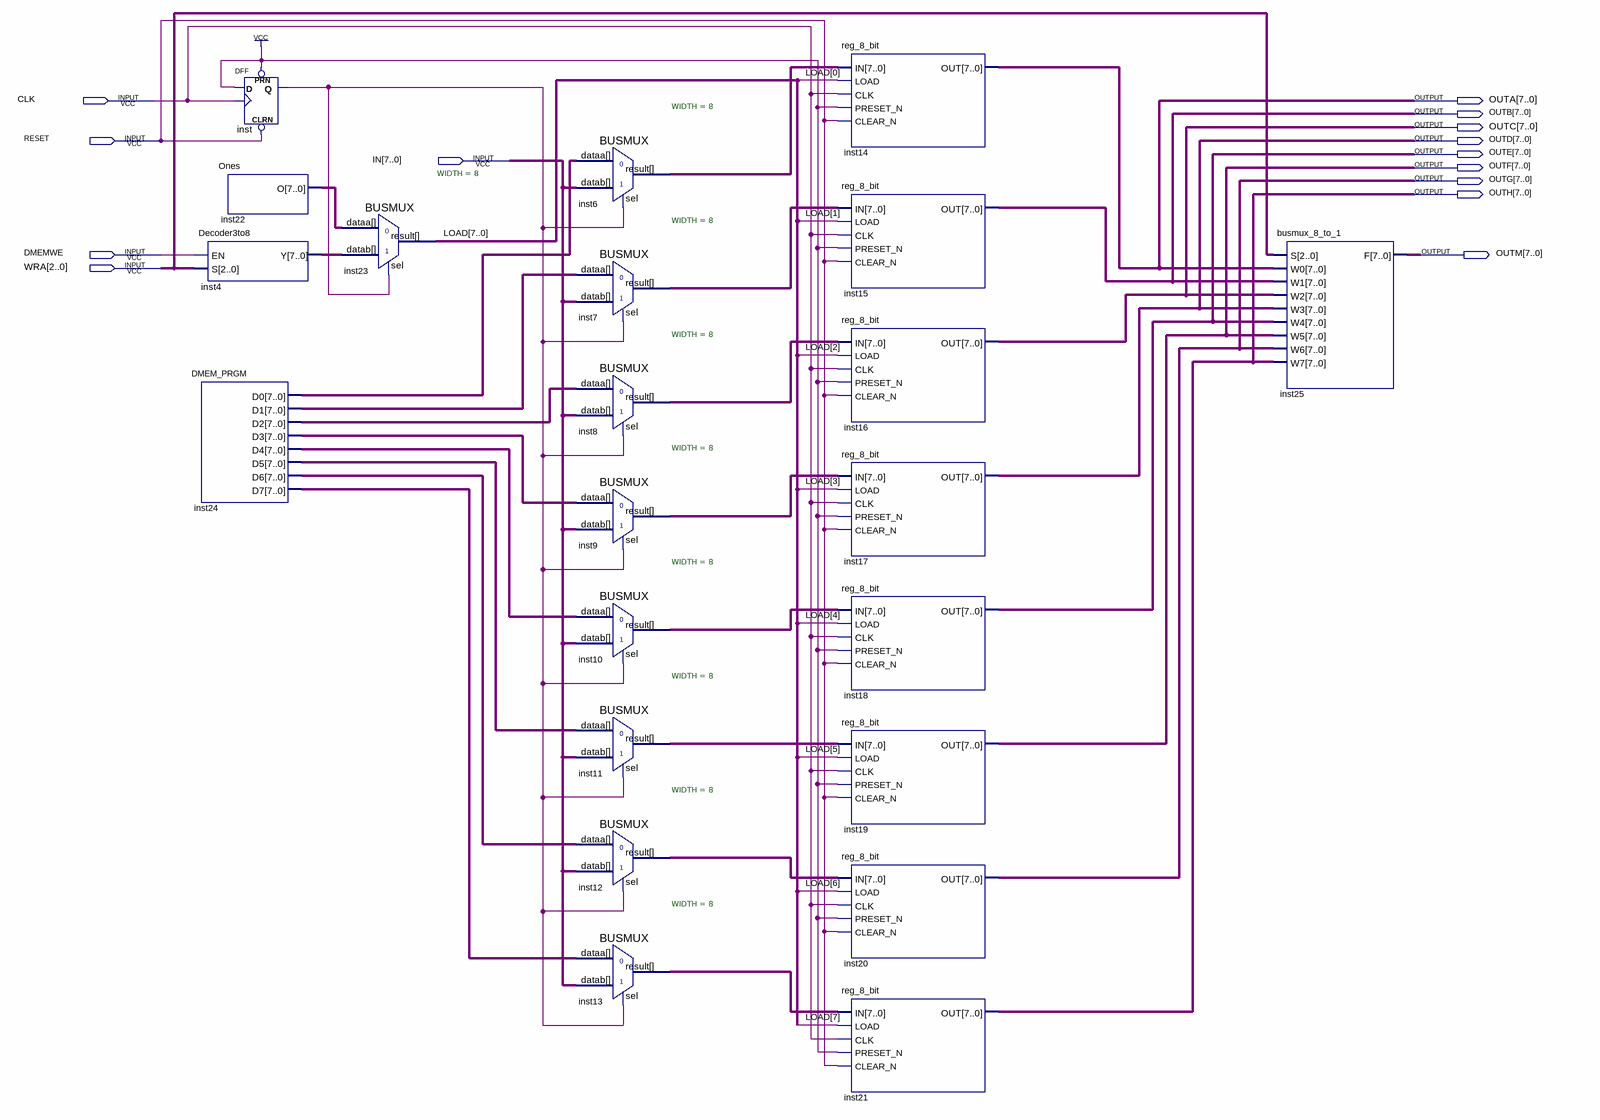
[diagram p0: schematic sheet]
// Quartus schematic DMEM.bdf as structural Verilog: 22 symbols, 14 pins
module DMEM (
  input  CLK,
  input  RESET,
  input  [7:0] IN,
  input  DMEMWE,
  input  [2:0] WRA,
  output [7:0] OUTA,
  output [7:0] OUTB,
  output [7:0] OUTC,
  output [7:0] OUTD,
  output [7:0] OUTE,
  output [7:0] OUTF,
  output [7:0] OUTG,
  output [7:0] OUTH,
  output [7:0] OUTM
);

  wire inst_q;
  wire [7:0] inst4_y, inst6_result, inst7_result, inst8_result, inst9_result, inst10_result, inst11_result,
       inst12_result, inst13_result, inst22_o, inst24_d0, inst24_d1, inst24_d2, inst24_d3, inst24_d4,
       inst24_d5, inst24_d6, inst24_d7, LOAD;

  Decoder3to8 inst4 (.EN(DMEMWE), .S(WRA), .Y(inst4_y));
  DMEM_PRGM inst24 (
    .D0(inst24_d0), .D1(inst24_d1), .D2(inst24_d2), .D3(inst24_d3), .D4(inst24_d4), .D5(inst24_d5),
    .D6(inst24_d6), .D7(inst24_d7));
  DFF inst (.CLRN(RESET), .CLK(CLK), .D(1'b1), .PRN(1'b1), .Q(inst_q));
  Ones inst22 (.O(inst22_o));
  BUSMUX #(.WIDTH(8)) inst23 (.datab(inst4_y), .sel(inst_q), .dataa(inst22_o), .result(LOAD));
  BUSMUX #(.WIDTH(8)) inst6 (.datab(IN), .sel(inst_q), .dataa(inst24_d0), .result(inst6_result));
  BUSMUX #(.WIDTH(8)) inst7 (.datab(IN), .sel(inst_q), .dataa(inst24_d1), .result(inst7_result));
  BUSMUX #(.WIDTH(8)) inst8 (.datab(IN), .sel(inst_q), .dataa(inst24_d2), .result(inst8_result));
  BUSMUX #(.WIDTH(8)) inst9 (.datab(IN), .sel(inst_q), .dataa(inst24_d3), .result(inst9_result));
  BUSMUX #(.WIDTH(8)) inst10 (.datab(IN), .sel(inst_q), .dataa(inst24_d4), .result(inst10_result));
  BUSMUX #(.WIDTH(8)) inst11 (.datab(IN), .sel(inst_q), .dataa(inst24_d5), .result(inst11_result));
  BUSMUX #(.WIDTH(8)) inst12 (.datab(IN), .sel(inst_q), .dataa(inst24_d6), .result(inst12_result));
  BUSMUX #(.WIDTH(8)) inst13 (.datab(IN), .sel(inst_q), .dataa(inst24_d7), .result(inst13_result));
  reg_8_bit inst14 (.IN(inst6_result), .LOAD(LOAD[0]), .CLK(CLK), .PRESET_N(1'b1), .CLEAR_N(RESET), .OUT(OUTA));
  reg_8_bit inst15 (.IN(inst7_result), .LOAD(LOAD[1]), .CLK(CLK), .PRESET_N(1'b1), .CLEAR_N(RESET), .OUT(OUTB));
  reg_8_bit inst16 (.IN(inst8_result), .LOAD(LOAD[2]), .CLK(CLK), .PRESET_N(1'b1), .CLEAR_N(RESET), .OUT(OUTC));
  reg_8_bit inst17 (.IN(inst9_result), .LOAD(LOAD[3]), .CLK(CLK), .PRESET_N(1'b1), .CLEAR_N(RESET), .OUT(OUTD));
  reg_8_bit inst18 (.IN(inst10_result), .LOAD(LOAD[4]), .CLK(CLK), .PRESET_N(1'b1), .CLEAR_N(RESET), .OUT(OUTE));
  reg_8_bit inst19 (.IN(inst11_result), .LOAD(LOAD[5]), .CLK(CLK), .PRESET_N(1'b1), .CLEAR_N(RESET), .OUT(OUTF));
  reg_8_bit inst20 (.IN(inst12_result), .LOAD(LOAD[6]), .CLK(CLK), .PRESET_N(1'b1), .CLEAR_N(RESET), .OUT(OUTG));
  reg_8_bit inst21 (.IN(inst13_result), .LOAD(LOAD[7]), .CLK(CLK), .PRESET_N(1'b1), .CLEAR_N(RESET), .OUT(OUTH));
  busmux_8_to_1 inst25 (
    .S(WRA), .W0(OUTA), .W1(OUTB), .W2(OUTC), .W3(OUTD), .W4(OUTE), .W5(OUTF), .W6(OUTG), .W7(OUTH), .F(OUTM));
endmodule
